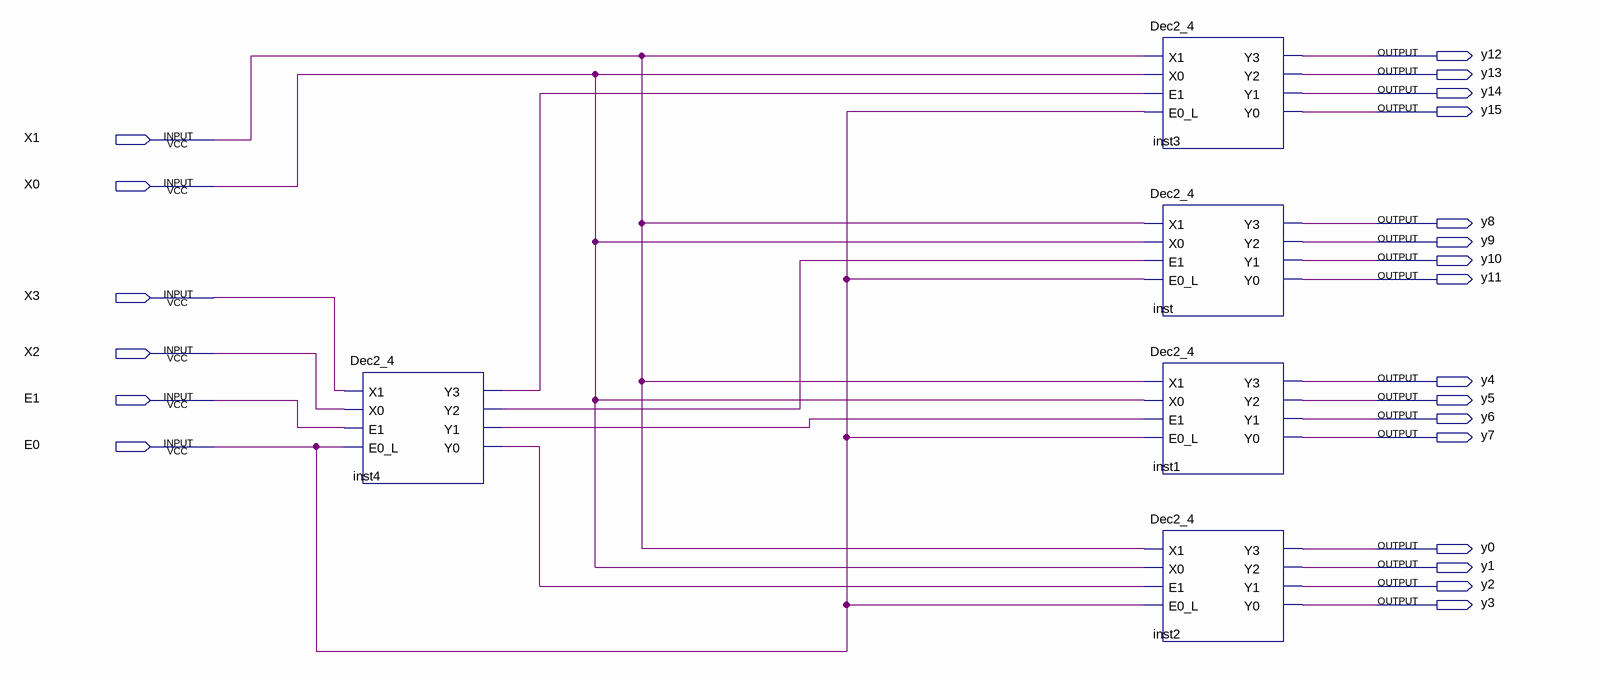
[diagram p0: schematic sheet]
// Quartus schematic Dec4_16.bdf as structural Verilog: 5 symbols, 22 pins
module Dec4_16 (
  input  X1,
  input  X0,
  input  X3,
  input  X2,
  input  E1,
  input  E0,
  output y12,
  output y13,
  output y14,
  output y15,
  output y8,
  output y9,
  output y10,
  output y11,
  output y4,
  output y5,
  output y6,
  output y7,
  output y0,
  output y1,
  output y2,
  output y3
);

  wire inst4_y0, inst4_y1, inst4_y2, inst4_y3;

  Dec2_4 inst4 (.X1(X3), .X0(X2), .E1(E1), .E0_L(E0), .Y3(inst4_y3), .Y2(inst4_y2), .Y1(inst4_y1), .Y0(inst4_y0));
  Dec2_4 inst3 (.X1(X1), .X0(X0), .E1(inst4_y3), .E0_L(E0), .Y3(y12), .Y2(y13), .Y1(y14), .Y0(y15));
  Dec2_4 inst (.X1(X1), .X0(X0), .E1(inst4_y2), .E0_L(E0), .Y3(y8), .Y2(y9), .Y1(y10), .Y0(y11));
  Dec2_4 inst1 (.X1(X1), .X0(X0), .E1(inst4_y1), .E0_L(E0), .Y3(y4), .Y2(y5), .Y1(y6), .Y0(y7));
  Dec2_4 inst2 (.X1(X1), .X0(X0), .E1(inst4_y0), .E0_L(E0), .Y3(y0), .Y2(y1), .Y1(y2), .Y0(y3));
endmodule
